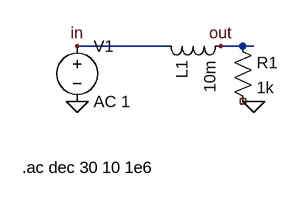
[diagram p0: schematic rl_highpass_ac.asc]
rl_highpass_ac.asc, the LTspice schematic file:
Version 4
SHEET 1 1200 900
WIRE 128 176 256 176
WIRE 336 176 384 176
FLAG 128 176 in
FLAG 336 176 out
FLAG 128 256 0
FLAG 384 256 0
SYMBOL voltage 128 160 R0
SYMATTR InstName V1
SYMATTR Value AC 1
SYMBOL ind 240 160 M90
SYMATTR InstName L1
SYMATTR Value 10m
SYMBOL res 352 160 R0
SYMATTR InstName R1
SYMATTR Value 1k
TEXT 48 352 Left 2 !.ac dec 30 10 1e6

The netlist it stands for:
* rl_highpass_ac.asc
V1 in 0 AC 1
L1 in out 10m
R1 out NC_01 1k
.ac dec 30 10 1e6
.backanno
.end